# EasyEDA schematic SCH_styresystemer_2026-04-27.json
TITLE: Styresystemer v1; REV: 1.0; Date: 2026-03-24; Sheet: 1/1; Drawn By: vetlebosoli; Company: Thilir Racing
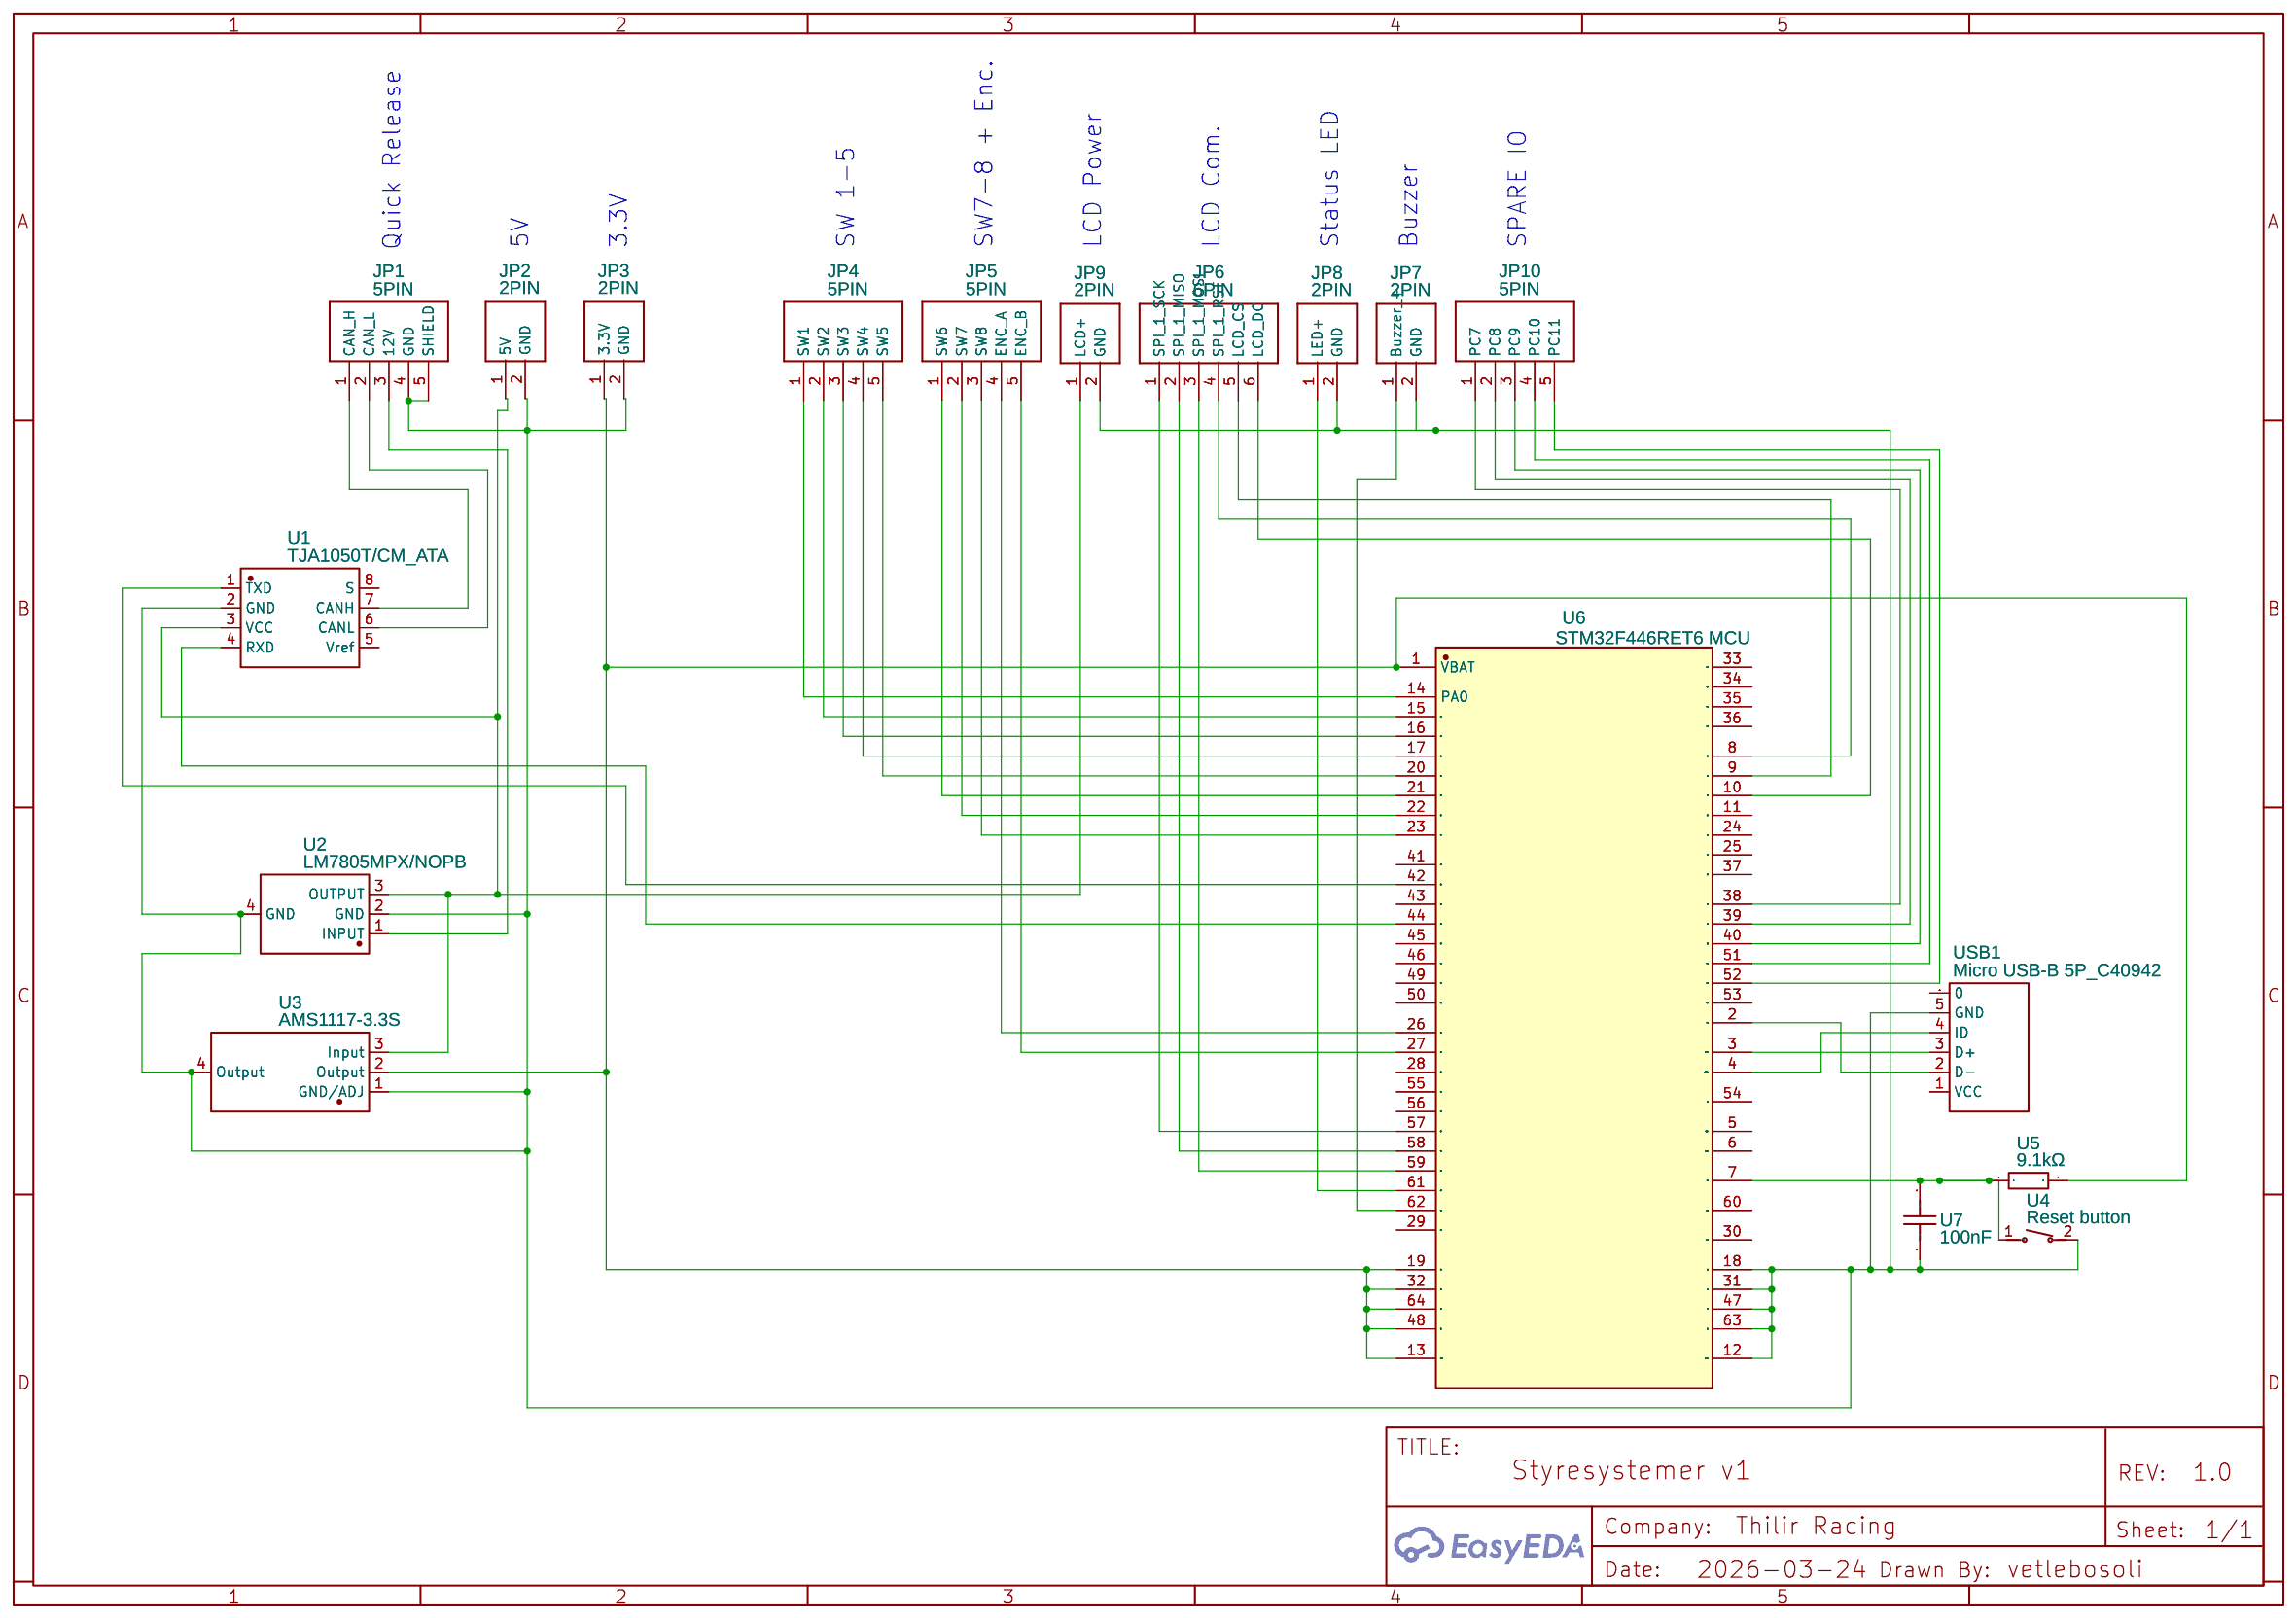
[diagram p0: schematic sheet]

## Parts
JP1  5PIN  [B5B-PH-K-S]
JP2  2PIN  [B2B-PH-K-S]
JP3  2PIN  [B2B-PH-K-S]
JP4  5PIN  [B5B-PH-K-S]
JP5  5PIN  [B5B-PH-K-S]
JP6  6PIN  [B6B-PH-K-S]
JP7  2PIN  [B2B-PH-K-S]
JP8  2PIN  [B2B-PH-K-S]
JP9  2PIN  [B2B-PH-K-S]
JP10  5PIN  [B5B-PH-K-S]
U1  TJA1050T/CM_ATA  [SOIC-8_L4.9-W3.9-P1.27-LS6.0-BL]
U2  LM7805MPX/NOPB  [SOT-223-4_L6.5-W3.5-P2.30-LS7.0-BR]
U3  AMS1117-3.3S  [SOT-223-4_L6.5-W3.5-P2.30-LS7.0-BL]
U4  Reset button  [KEY-SMD_L6.0-W6.0-LS6.6]
U5  9.1kΩ  [R0402]
U6  STM32F446RET6 MCU  [STM32F446RET6]
U7  100nF  [CAP-TH_L13.0-W5.0-P10.00-D0.6]
USB1  Micro USB-B 5P_C40942  [MICRO-USB-SMD_5P-P0.65-H-M_MICRO-USB-5P]

## Library data of the parts
JP1 JP4 JP5 JP10 = 5PIN: sourceId: C6GgPNnXV
JP2 JP3 JP7-JP9 = 2PIN: Contributor: k1konn
JP6 = 6PIN: Contributor: Vexy
U1 = TJA1050T/CM_ATA: Supplier: LCSC; Supplier Part: C9900150021; Manufacturer: null; JLCPCB Part Class: Extended Part; Contributor: lcsc
U2 = LM7805MPX/NOPB: Contributor: LCSC; Supplier: LCSC; Supplier Part: C2848241; Manufacturer: TI(德州仪器); JLCPCB Part Class: Extended Part
U3 = AMS1117-3.3S: Contributor: LCSC; Supplier: LCSC; Supplier Part: C2842296; Manufacturer: KEXIN(科信); JLCPCB Part Class: Extended Part
U4 = BUTTON_C9900040040: Contributor: lcsc; Supplier: LCSC; Supplier Part: C9900040040; Manufacturer: null; Manufacturer Part: BUTTON; JLCPCB Part Class: Extended Part
U5 = HPCR0402F9K10K9: Contributor: LCSC; Supplier: LCSC; Supplier Part: C365063; Manufacturer: RESI(开步睿思); JLCPCB Part Class: Extended Part
U6 = STM32F446RET6 MCU: Supplier: LCSC; Manufacturer: STMicroelectronics; Supplier Part: C69336; SMT Type: Extend; subpart_no: 1; JLCPCB SMD: Yes; LCSC Assembly: Yes; Assembly Type: smtWeld; Paste Type: expand; Contributor: jnthao
U7 = B32671P5104K000: Contributor: lcsc; Supplier: LCSC; Supplier Part: C3785376; Manufacturer: TDK
USB1 = Micro USB-B 5P_C40942: Supplier: LCSC; Manufacturer: 精拓金; Manufacturer Part: 920-D62A2021S10100; Supplier Part: C40942; JLCPCB Part Class: Extended Part

## Nets
Net-(JP1-1): JP1.1(CAN_H) U1.7(CANH)
Net-(JP1-2): JP1.2(CAN_L) U1.6(CANL)
Net-(JP1-3): JP1.3(12V) U2.1(INPUT)
Net-(JP1-4): JP1.4(GND) JP1.5(SHIELD) JP2.2(GND) JP3.2(GND) JP7.2(GND) JP8.2(GND) JP9.2(GND) U1.2(GND) U2.2(GND) U2.4(GND) U3.1(GND/ADJ) U3.4(Output) U4.2(B) U6.12(VSSA/VREF-) U6.18(VSS) U6.31(VSS) U6.47(VSS) U6.63(VSS) U7.1 USB1.5(GND)
Net-(JP2-1): JP2.1(5V) JP9.1(LCD+) U1.3(VCC) U2.3(OUTPUT) U3.3(Input)
Net-(JP3-1): JP3.1(3.3V) U3.2(Output) U5.2 U6.1(VBAT) U6.13(VDDA/VREF+) U6.19(VDD) U6.32(VDD) U6.48(VDD) U6.64(VDD)
Net-(JP4-1): JP4.1(SW1) U6.14(PA0)
Net-(JP4-2): JP4.2(SW2) U6.15(PA1)
Net-(JP4-3): JP4.3(SW3) U6.16(PA2)
Net-(JP4-4): JP4.4(SW4) U6.17(PA3)
Net-(JP4-5): JP4.5(SW5) U6.20(PA4)
Net-(JP5-1): JP5.1(SW6) U6.21(PA5)
Net-(JP5-2): JP5.2(SW7) U6.22(PA6)
Net-(JP5-3): JP5.3(SW8) U6.23(PA7)
Net-(JP5-4): JP5.4(ENC_A) U6.26(PB0)
Net-(JP5-5): JP5.5(ENC_B) U6.27(PB1)
Net-(JP6-1): JP6.1(SPI 1_SCK) U6.57(PB5)
Net-(JP6-2): JP6.2(SPI 1_MISO) U6.58(PB6)
Net-(JP6-3): JP6.3(SPI 1_MOSI) U6.59(PB7)
Net-(JP6-4): JP6.4(SPI 1_RST) U6.8(PC0)
Net-(JP6-5): JP6.5(LCD_CS) U6.9(PC1)
Net-(JP6-6): JP6.6(LCD_DC) U6.10(PC2)
Net-(JP7-1): JP7.1(Buzzer +) U6.62(PB9)
Net-(JP8-1): JP8.1(LED+) U6.61(PB8)
Net-(JP10-1): JP10.1(PC7) U6.38(PC7)
Net-(JP10-2): JP10.2(PC8) U6.39(PC8)
Net-(JP10-3): JP10.3(PC9) U6.40(PC9)
Net-(JP10-4): JP10.4(PC10) U6.51(PC10)
Net-(JP10-5): JP10.5(PC11) U6.52(PC11)
Net-(U1-1): U1.1(TXD) U6.42(PA9)
Net-(U1-4): U1.4(RXD) U6.44(PA11)
Net-(U4-1): U4.1(A) U5.1 U6.7(NRST) U7.2
Net-(U6-2): U6.2(PC13) USB1.2(D-)
Net-(U6-3): U6.3(PC14-OSC32_IN) USB1.3(D+)
Net-(U6-4): U6.4(PC15-OSC32_OUT) USB1.4(ID)

Not connected (* = marked no-connect by the designer): U1 5(Vref) 8(S); U6 5(PH0-OSC_IN) 6(PH1-OSC_OUT) 11(PC3) 24(PC4) 25(PC5) 28(PB2) 29(PB10) 30(VCAP_1) 33(PB12) 34(PB13) 35(PB14) 36(PB15) 37(PC6) 41(PA8) 43(PA10) 45(PA12) 46(PA13) 49(PA14) 50(PA15) 53(PC12) 54(PD2) 55(PB3) 56(PB4) 60(BOOT0); USB1 0 1(VCC)

## Notes on the sheet
- Quick Release
- 5V
- 3.3V
- SW 1-5
- SW7-8 + Enc.
- LCD Power
- LCD Com.
- Status LED
- Buzzer
- SPARE IO
